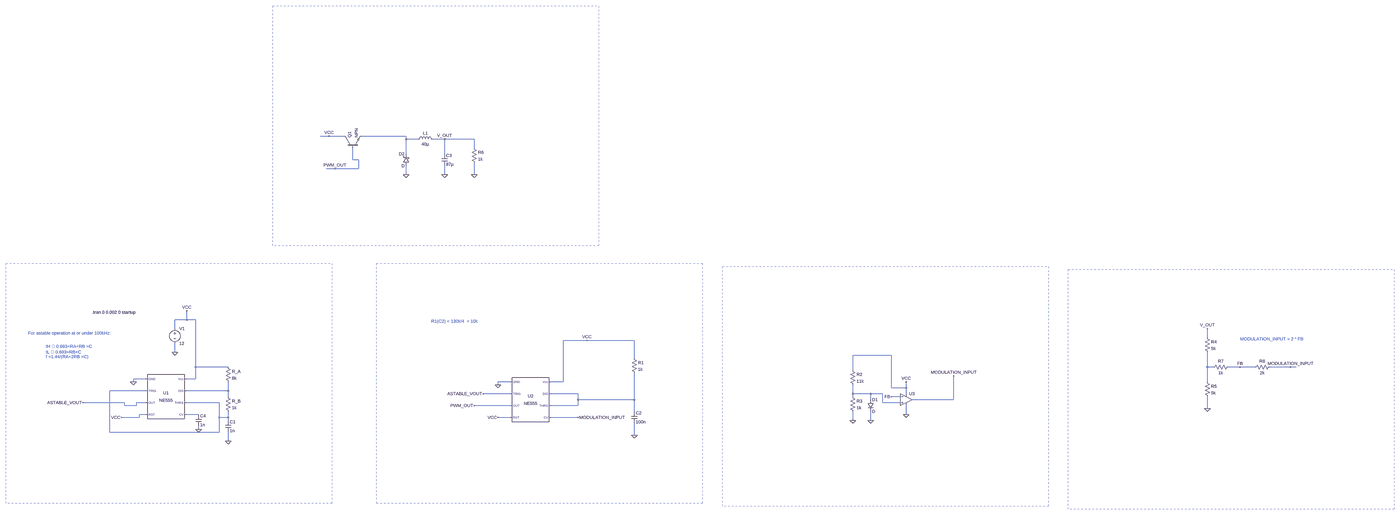
[diagram p0: schematic Draft1.asc, whole sheet]
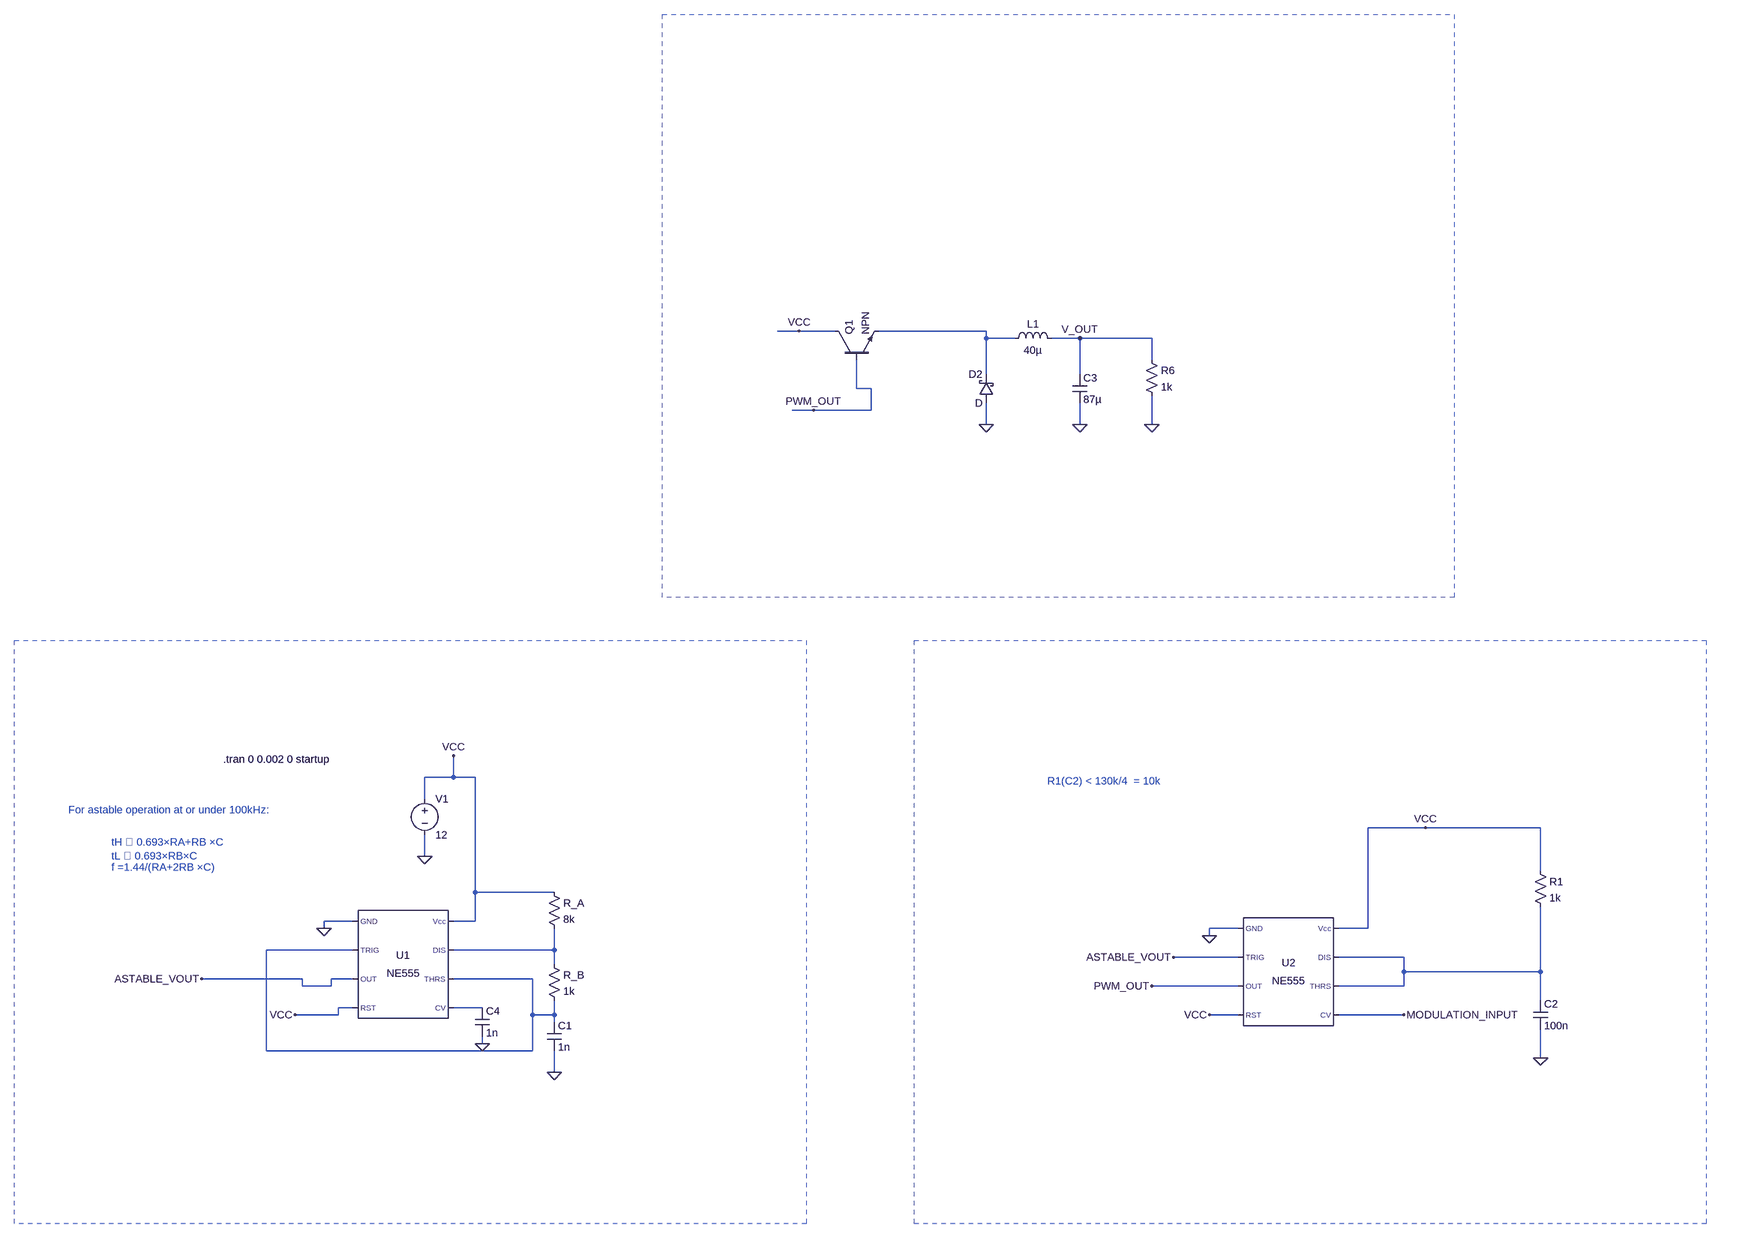
[diagram p1: schematic Draft1.asc, part, row 1 of 1, column 1 of 2]
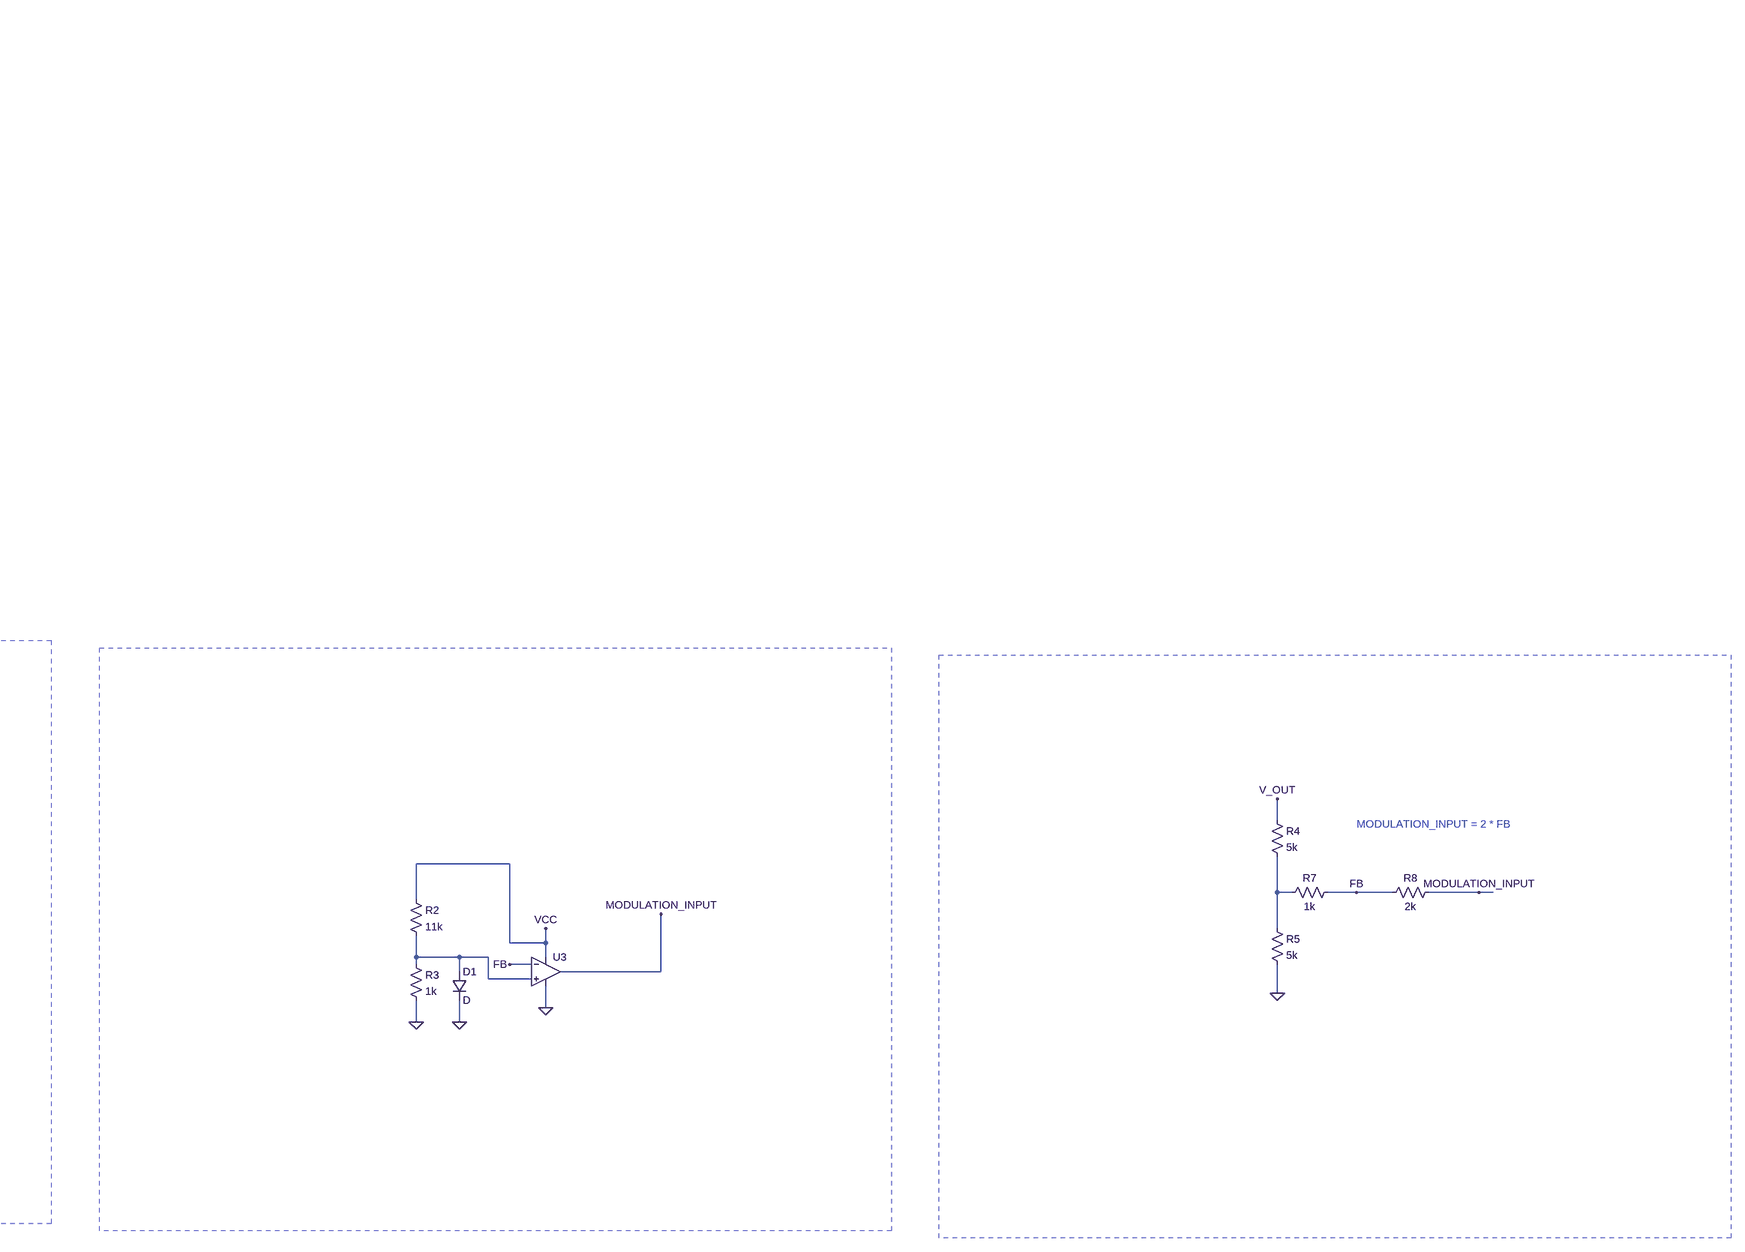
[diagram p2: schematic Draft1.asc, part, row 1 of 1, column 2 of 2]
Draft1.asc, the LTspice schematic file:
Version 4.1
SHEET 1 7284 724
WIRE 1024 -1296 976 -1296
WIRE 1104 -1296 1024 -1296
WIRE 1440 -1296 1200 -1296
WIRE 1440 -1280 1440 -1296
WIRE 1504 -1280 1440 -1280
WIRE 1648 -1280 1584 -1280
WIRE 1808 -1280 1648 -1280
WIRE 1808 -1232 1808 -1280
WIRE 1440 -1200 1440 -1280
WIRE 1648 -1200 1648 -1280
WIRE 1152 -1168 1152 -1232
WIRE 1184 -1168 1152 -1168
WIRE 1056 -1120 1008 -1120
WIRE 1184 -1120 1184 -1168
WIRE 1184 -1120 1056 -1120
WIRE 1440 -1088 1440 -1136
WIRE 1648 -1088 1648 -1136
WIRE 1808 -1088 1808 -1152
WIRE 256 -304 256 -352
WIRE 256 -304 192 -304
WIRE 304 -304 256 -304
WIRE 192 -256 192 -304
WIRE 6272 -208 6272 -256
WIRE 2416 -192 2288 -192
WIRE 2672 -192 2416 -192
WIRE 192 -128 192 -176
WIRE 4416 -112 4208 -112
WIRE 2672 -96 2672 -192
WIRE 304 -48 304 -304
WIRE 480 -48 304 -48
WIRE 6272 -48 6272 -128
WIRE 6304 -48 6272 -48
WIRE 6448 -48 6384 -48
WIRE 6528 -48 6448 -48
WIRE 6720 -48 6608 -48
WIRE 6752 -48 6720 -48
WIRE 4208 -32 4208 -112
WIRE 32 16 -32 16
WIRE 304 16 304 -48
WIRE 304 16 256 16
WIRE -32 32 -32 16
WIRE 2000 32 1936 32
WIRE 2288 32 2288 -192
WIRE 2288 32 2224 32
WIRE 6272 32 6272 -48
WIRE 1936 48 1936 32
WIRE 4416 64 4416 -112
WIRE 4496 64 4496 32
WIRE 4496 64 4416 64
WIRE 32 80 -160 80
WIRE 480 80 480 32
WIRE 480 80 256 80
WIRE 2000 96 1856 96
WIRE 2368 96 2224 96
WIRE 4208 96 4208 48
WIRE 4304 96 4208 96
WIRE 4368 96 4304 96
WIRE 4496 96 4496 64
WIRE 480 112 480 80
WIRE 4208 112 4208 96
WIRE 4464 112 4416 112
WIRE 2368 128 2368 96
WIRE 2672 128 2672 -16
WIRE 2672 128 2368 128
WIRE 4304 128 4304 96
WIRE 4752 128 4752 0
WIRE 4752 128 4528 128
WIRE -80 144 -304 144
WIRE 32 144 -16 144
WIRE 432 144 256 144
WIRE 4368 144 4368 96
WIRE 4464 144 4368 144
WIRE -80 160 -80 144
WIRE -16 160 -16 144
WIRE -16 160 -80 160
WIRE 2000 160 1808 160
WIRE 2368 160 2368 128
WIRE 2368 160 2224 160
WIRE 6272 176 6272 112
WIRE 2672 192 2672 128
WIRE 32 208 0 208
WIRE 320 208 256 208
WIRE 4496 208 4496 160
WIRE 0 224 0 208
WIRE 0 224 -96 224
WIRE 432 224 432 144
WIRE 480 224 480 192
WIRE 480 224 432 224
WIRE 2000 224 1936 224
WIRE 2368 224 2224 224
WIRE 480 240 480 224
WIRE 4208 240 4208 192
WIRE 4304 240 4304 192
WIRE 320 288 320 272
WIRE -160 304 -160 80
WIRE 432 304 432 224
WIRE 432 304 -160 304
WIRE 2672 320 2672 256
WIRE 480 352 480 304
FLAG -32 32 0
FLAG 192 -128 0
FLAG 480 352 0
FLAG -304 144 ASTABLE_VOUT
FLAG 256 -352 VCC
FLAG -96 224 VCC
FLAG 1936 48 0
FLAG 1808 160 PWM_OUT
FLAG 2416 -192 VCC
FLAG 1936 224 VCC
FLAG 1856 96 ASTABLE_VOUT
FLAG 2368 224 MODULATION_INPUT
FLAG 2672 320 0
FLAG 4752 0 MODULATION_INPUT
FLAG 4496 32 VCC
FLAG 4496 208 0
FLAG 4208 240 0
FLAG 4304 240 0
FLAG 4416 112 FB
FLAG 1440 -1088 0
FLAG 1648 -1088 0
FLAG 1648 -1280 V_OUT
FLAG 6448 -48 FB
FLAG 6272 -256 V_OUT
FLAG 6272 176 0
FLAG 1024 -1296 VCC
FLAG 1056 -1120 PWM_OUT
FLAG 1808 -1088 0
FLAG 320 288 0
FLAG 6720 -48 MODULATION_INPUT
SYMBOL Misc\\NE555 144 112 R0
SYMATTR InstName U1
SYMBOL res 464 -64 R0
SYMATTR InstName R_A
SYMATTR Value 8k
SYMBOL res 464 96 R0
SYMATTR InstName R_B
SYMATTR Value 1k
SYMBOL voltage 192 -272 R0
WINDOW 123 0 0 Left 0
WINDOW 39 0 0 Left 0
SYMATTR InstName V1
SYMATTR Value 12
SYMBOL cap 464 240 R0
SYMATTR InstName C1
SYMATTR Value 1n
SYMBOL Misc\\NE555 2112 128 R0
SYMATTR InstName U2
SYMBOL cap 2656 192 R0
SYMATTR InstName C2
SYMATTR Value 100n
SYMBOL res 2656 -112 R0
SYMATTR InstName R1
SYMATTR Value 1k
SYMBOL res 4192 -48 R0
SYMATTR InstName R2
SYMATTR Value 11k
SYMBOL res 4192 96 R0
SYMATTR InstName R3
SYMATTR Value 1k
SYMBOL diode 4288 128 R0
SYMATTR InstName D1
SYMBOL ind 1488 -1264 R270
WINDOW 0 32 56 VTop 2
WINDOW 3 5 56 VBottom 2
SYMATTR InstName L1
SYMATTR Value 40µ
SYMBOL cap 1632 -1200 R0
SYMATTR InstName C3
SYMATTR Value 87µ
SYMBOL res 6256 -224 R0
SYMATTR InstName R4
SYMATTR Value 5k
SYMBOL res 6256 16 R0
SYMATTR InstName R5
SYMATTR Value 5k
SYMBOL res 1792 -1248 R0
SYMATTR InstName R6
SYMATTR Value 1k
SYMBOL OpAmps\\UniversalOpAmp2 4496 128 R0
SYMATTR InstName U3
SYMBOL npn 1104 -1232 R270
SYMATTR InstName Q1
SYMBOL cap 304 208 R0
SYMATTR InstName C4
SYMATTR Value 1n
SYMBOL schottky 1456 -1136 R180
WINDOW 0 24 64 Left 2
WINDOW 3 24 0 Left 2
SYMATTR InstName D2
SYMBOL res 6624 -64 R90
WINDOW 0 0 56 VBottom 2
WINDOW 3 32 56 VTop 2
SYMATTR InstName R8
SYMATTR Value 2k
SYMBOL res 6400 -64 R90
WINDOW 0 0 56 VBottom 2
WINDOW 3 32 56 VTop 2
SYMATTR InstName R7
SYMATTR Value 1k
TEXT -256 -344 Left 2 !.tran 0 0.002 0 startup
TEXT -504 -160 Left 2 ;tH ≅ 0.693×RA+RB ×C\ntL ≅ 0.693×RB×C
TEXT -504 -104 Left 2 ;f =1.44/(RA+2RB ×C)
TEXT -600 -232 Left 2 ;For astable operation at or under 100kHz:
TEXT 1576 -296 Left 2 ;R1(C2) < 130k/4  = 10k
TEXT 6448 -200 Left 2 ;MODULATION_INPUT = 2 * FB
RECTANGLE Normal 1040 688 -720 -608 2
RECTANGLE Normal 3040 688 1280 -608 2
RECTANGLE Normal 5264 704 3504 -592 2
RECTANGLE Normal 7280 720 5520 -576 2
RECTANGLE Normal 2480 -704 720 -2000 2

The netlist it stands for:
* Draft1.asc
X§U1 0 N003 ASTABLE_VOUT VCC N007 N003 N004 VCC NE555  ; pins GND TRIG OUT RST CV THRS DIS Vcc
R_A VCC N004 8k
R_B N004 N003 1k
V1 VCC 0 12
C1 N003 0 1n
X§U2 0 ASTABLE_VOUT PWM_OUT VCC MODULATION_INPUT N005 N005 VCC NE555  ; pins GND TRIG OUT RST CV THRS DIS Vcc
C2 N005 0 100n
R1 VCC N005 1k
R2 VCC N006 11k
R3 N006 0 1k
D1 N006 0 D
L1 N001 V_OUT 40µ
C3 V_OUT 0 87µ
R4 V_OUT N002 5k
R5 N002 0 5k
R6 V_OUT 0 1k
X§U3 N006 FB VCC 0 MODULATION_INPUT level2 Avol=1Meg GBW=10Meg Slew=10Meg Ilimit=25m Rail=0 Vos=0 En=0 Enk=0 In=0 Ink=0 Rin=500Meg  ; pins In+ In- V+ V- OUT
Q1 VCC PWM_OUT N001 0 NPN
C4 N007 0 1n
D2 0 N001 D
R8 MODULATION_INPUT FB 2k
R7 FB N002 1k
.model D D
.lib standard.dio
.model NPN NPN
.model PNP PNP
.lib standard.bjt
.tran 0 0.002 0 startup
* tH ≅ 0.693×RA+RB ×C
* tL ≅ 0.693×RB×C
* f =1.44/(RA+2RB ×C)
* For astable operation at or under 100kHz:
* R1(C2) < 130k/4  = 10k
* MODULATION_INPUT = 2 * FB
.lib NE555.sub
.lib UniversalOpAmp2.lib
.backanno
.end